# Altium schematic sheet RF_LoRa_&_GPS.SchDoc
size A; SheetNumber: 3; SheetTotal: 7
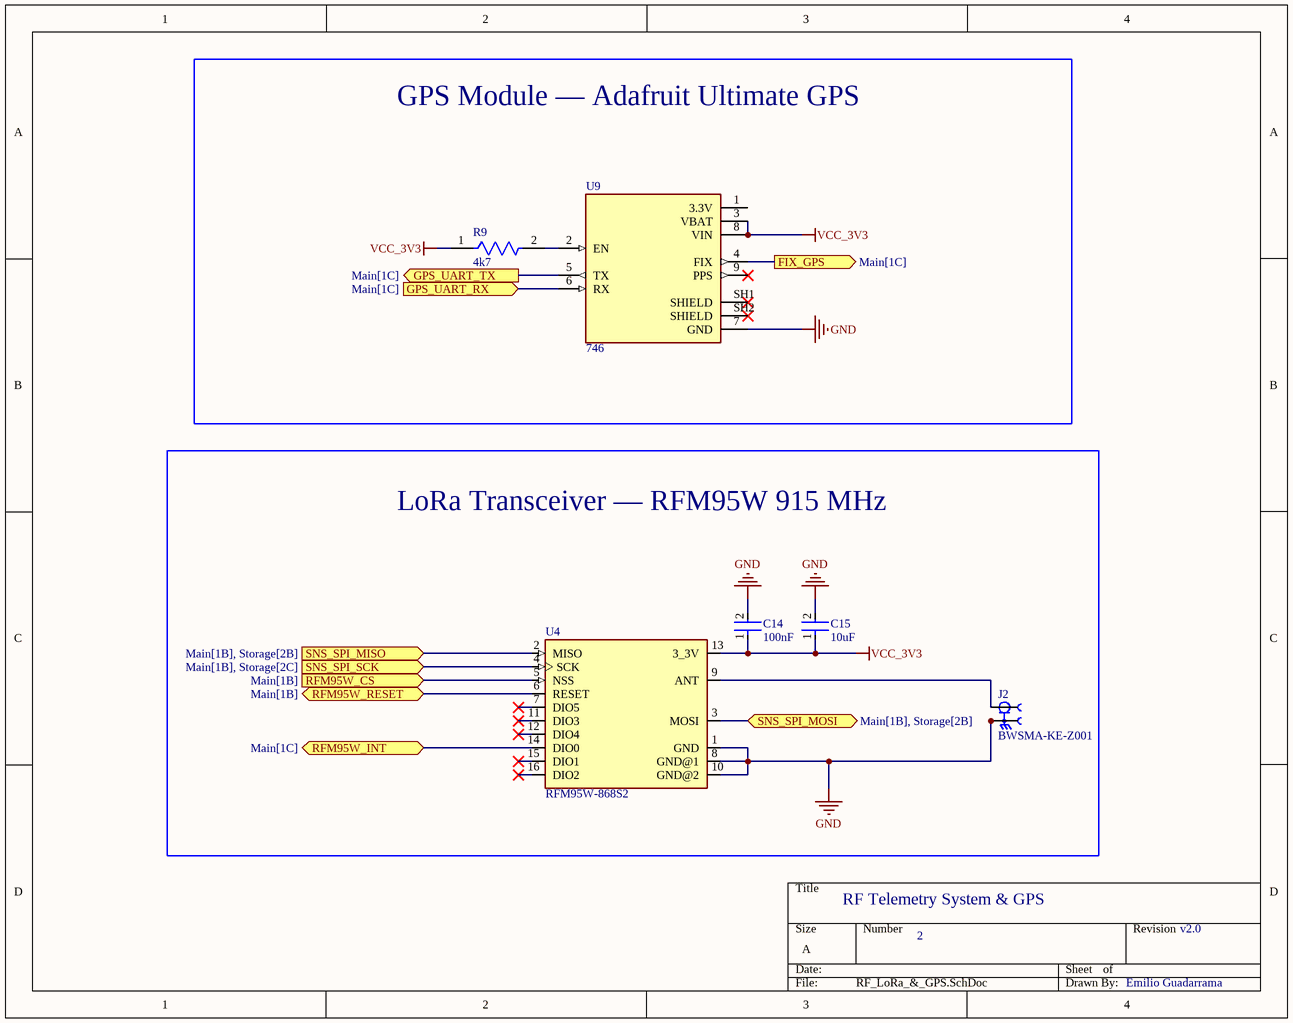
[diagram p0: RF_LoRa_&_GPS.SchDoc]

## Parts
C14  100nF  [FP-C0805C-DN-MFG]
C15  10uF  [FP-C0805C-DN-MFG]
J2  BWSMA-KE-Z001  [BAT_WIRELESS_BWSMA-KE-Z001]
R9  4k7  [FP-MCT0603-IPC_A]
U4  RFM95W-868S2  [XCVR_RFM95W-868S2]
U9  746  [XCVR_746]

## Blocks framed on the sheet
GPS Module — Adafruit Ultimate GPS: R9 U9
LoRa Transceiver — RFM95W 915 MHz: C14 C15 J2 U4

## Ports
FIX_GPS (out, see Main[1C]), GPS_UART_RX (in, see Main[1C]), GPS_UART_TX (out, see Main[1C]), RFM95W_CS (in, see Main[1B]), RFM95W_INT (bidir, see Main[1C]), RFM95W_RESET (bidir, see Main[1B]), SNS_SPI_MISO (in, see Main[1B], Storage[2B]), SNS_SPI_MOSI (bidir, see Main[1B], Storage[2B]), SNS_SPI_SCK (in, see Main[1B], Storage[2C])

## Nets
GND: C14.2 C15.2 J2.2_1 J2.2_2 J2.2_3 J2.2_4 U4.1(GND) U4.8(GND@1) U4.10(GND@2) U9.7(GND)
VCC_3V3: C14.1 C15.1 R9.1 U4.13(3_3V) U9.3(VBAT) U9.8(VIN)
FIX_GPS: U9.4(FIX) ; port FIX_GPS
GPS_UART_RX: U9.6(RX) ; port GPS_UART_RX
GPS_UART_TX: U9.5(TX) ; port GPS_UART_TX
RFM95W_CS: U4.5(NSS) ; port RFM95W_CS
RFM95W_INT: U4.14(DIO0) ; port RFM95W_INT
RFM95W_RESET: U4.6(RESET) ; port RFM95W_RESET
SNS_SPI_MISO: U4.2(MISO) ; port SNS_SPI_MISO
SNS_SPI_MOSI: U4.3(MOSI) ; port SNS_SPI_MOSI
SNS_SPI_SCK: U4.4(SCK) ; port SNS_SPI_SCK
NetJ2_1: J2.1 U4.9(ANT)
NetR9_2: R9.2 U9.2(EN)

Not connected (* = marked no-connect by the designer): U4 7(DIO5)* 11(DIO3)* 12(DIO4)* 15(DIO1)* 16(DIO2)*; U9 1(3.3V) 9(PPS)* SH1(SHIELD)* SH2(SHIELD)*

## Notes on the sheet
- RF Telemetry System & GPS
- 2
- v2.0
- Emilio Guadarrama

## Library data of the parts
C14 C15 = CMP-2007-00279-2: CAP CER 0.1UF 50V X7R 0805; Manufacturer Part Number: C0805C104K5RACTU; Manufacturer: KEMET; Value: 0.10 μF; Tolerance: 0.1; Temperature Coefficient: 30ppm/°C; Material: Ceramic; Device Class L2: Capacitors; Temperature Range Low: -55°C; Voltage Rating: 50 V; Digikey Description: CAP CER 0.1UF 50V X7R 0805; Category: Cap; ComponentLink2Description: Datasheet; Octopart: https://octopart.com/c0805c104k5ractu-kemet-143926; RoHS: TRUE; ComponentLink2URL: https://content.kemet.com/datasheets/KEM_C1003_C0G_SMD.pdf; Temperature Characteristic: X7R; Temperature: -55°C to +125°C; Height: 0.88mm; Temperature Range High: +125°C; Device Class L1: Passive Components; Automotive: No; Lead Free: Yes; Ipc Land Pattern Name: CAPC200125X78; Device Class L3: Ceramic Capacitors; Mouser Description: Cap Ceramic 0.1uF 50V X7R 10% SMD 2.0 x 1.2 mm 125 C Paper T/R; Capacitance: 0.10 μF; Package: C0805C-DN
J2 = BWSMA-KE-Z001: 1 Inner bore SMA Board Edge Positive foot -65â„ƒ~+165â„ƒ 50Î© Plugin RF Connectors / Coaxial Connectors ROHS; MF: Bat Wireless; SnapEDA_Link: https://www.snapeda.com/parts/BWSMA-KE-Z001/Bat+Wireless/view-part/?ref=snap; Package: None; Value: *; MP: BWSMA-KE-Z001; Check_prices: https://www.snapeda.com/parts/BWSMA-KE-Z001/Bat+Wireless/view-part/?ref=eda
R9 = CMP-02407-011165-1: RES SMD 100 OHM 1% 1/8W 0603; Temperature Coefficient: 25ppm/°C; Resistance: 20kR; Power Rating: 125mW; Tolerance: 0.1%; Voltage Rating: 75V; Length: 1.55mm; Case Code (Imperial): 0603; Case/Package: 0603; Construction: Rectangular; Package Quantity: 1000; Number of Terminations: 2; Termination: SMD/SMT; Resistor Type: Thin Film; Features: Automotive AEC-Q200; Series: MCT 0603 - Precision; Max Operating Temperature: 155°C; Depth: 0.85mm; Max Power Dissipation: 125mW; Min Operating Temperature: -55°C; Width: 0.033inch; Case Code (Metric): 1608; Packaging: Tape and Reel; Weight: 6.7E-05oz; Military Standard: Not; Height: 0.022inch
U4 = RFM95W-868S2: General ISM < 1GHz LoRaâ„¢ Transceiver Module 868MHz Antenna Not Included Surface Mount; MF: RF; Package: Non Standard RF Solutions; Price: None; Check_prices: https://www.snapeda.com/parts/RFM95W-868S2/RF+Solutions/view-part/?ref=eda; Value: *; SnapEDA_Link: https://www.snapeda.com/parts/RFM95W-868S2/RF+Solutions/view-part/?ref=snap; MP: RFM95W-868S2; Availability: In Stock; Purchase-URL: https://pricing.snapeda.com/search?q=RFM95W-868S2&ref=eda
U9 = 746: Ultimate GPS Breakout, 66 channel, 10 Hz updates, 5 V, -165 dBm, MTK3339 Chipset | Adafruit Industries 746; SnapEDA_Link: https://www.snapeda.com/parts/746/Adafruit+Industries/view-part/?ref=snap; Package: NON STANDARD-11 Adafruit; Value: *; MF: Adafruit Industries; MP: 746; Check_prices: https://www.snapeda.com/parts/746/Adafruit+Industries/view-part/?ref=eda